# Altium schematic sheet Melanson Tech - PWM Generator.SchDoc
size B
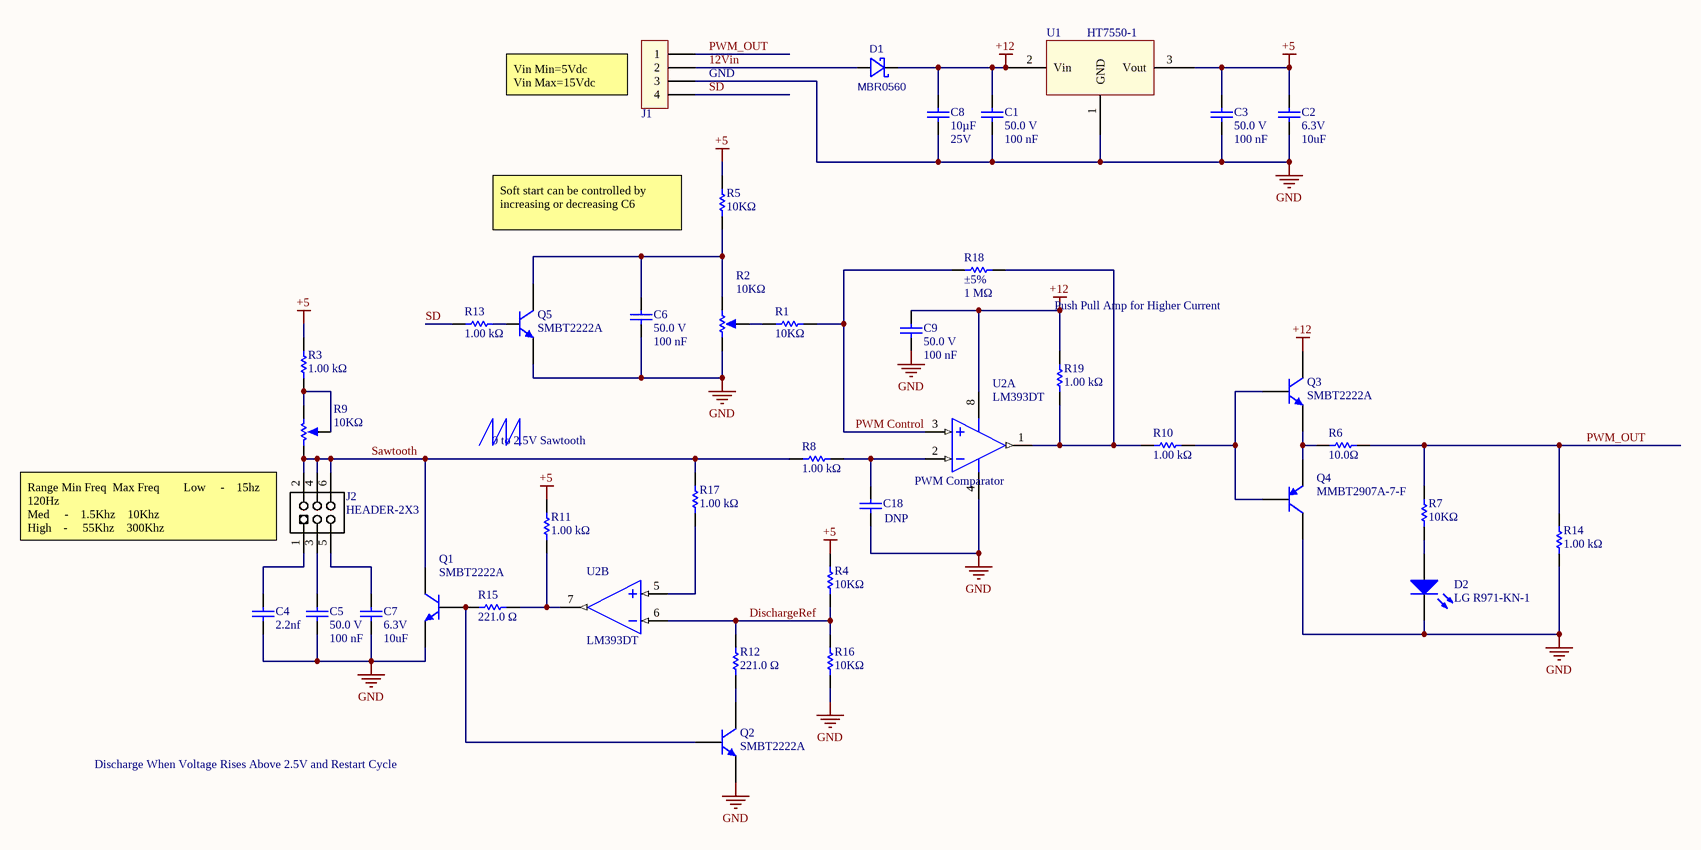
[diagram p0: Melanson Tech - PWM Generator.SchDoc]

## Parts
C1  Voltage Rating (DC): 50.0 V  Capacitance: 100 nF  [Cap,0805]  (hidden comment: 08055C104JAT2A)
C2  Voltage - Rated: 6.3V  Capacitance: 10uF  [Cap,0805]  (hidden comment: CL21A106KQFNNNG)
C3  Voltage Rating (DC): 50.0 V  Capacitance: 100 nF  [Cap,0805]  (hidden comment: 08055C104JAT2A)
C4  2.2nf  [CAP, 0805, HD]
C5  Voltage Rating (DC): 50.0 V  Capacitance: 100 nF  [Cap,0805]  (hidden comment: 08055C104JAT2A)
C6  Voltage Rating (DC): 50.0 V  Capacitance: 100 nF  [Cap,0805]  (hidden comment: 08055C104JAT2A)
C7  Voltage - Rated: 6.3V  Capacitance: 10uF  [Cap,0805]  (hidden comment: CL21A106KQFNNNG)
C8  Capacitance: 10µF  Voltage - Rated: 25V  [Cap, 1206]  (hidden comment: C3216X7R1E106K160AB)
C9  Voltage Rating (DC): 50.0 V  Capacitance: 100 nF  [Cap,0805]  (hidden comment: 08055C104JAT2A)
C18  Capacitance: DNP  [CAP, 0805, HD]  (hidden comment: GRM21A5C2E101JW01D)
D1  MBR0560  [SOD123]
D2  LG R971-KN-1  [LED,0805]
J1  Generic Header  [Header,4POS,0.1",Vert]  (value not drawn)
J2  HEADER-2X3  [HEADER-2X3]
Q1  SMBT2222A  [SOT23-3]
Q2  SMBT2222A  [SOT23-3]
Q3  SMBT2222A  [SOT23-3]
Q4  MMBT2907A-7-F  [SOT23-3]
Q5  SMBT2222A  [SOT23-3]
R1  Resistance: 10KΩ  [res, 0805, HD]  (hidden comment: Vishay / Dale CRCW080510K0FKTA)
R2  Resistance: 10KΩ  [Res,TH,POT,TopAdj]  (hidden comment: CT94EW103)
R3  Resistance: 1.00 kΩ  [res, 0805, HD]  (hidden comment: Vishay CRCW08051K00JNEA)
R4  Resistance: 10KΩ  [res, 0805, HD]  (hidden comment: Vishay / Dale CRCW080510K0FKTA)
R5  Resistance: 10KΩ  [res, 0805, HD]  (hidden comment: Vishay / Dale CRCW080510K0FKTA)
R6  Resistance: 10.0Ω  [res, 0805, HD]  (hidden comment: RMCF0805JT10R0)
R7  Resistance: 10KΩ  [res, 0805, HD]  (hidden comment: Vishay / Dale CRCW080510K0FKTA)
R8  Resistance: 1.00 kΩ  [res, 0805, HD]  (hidden comment: Vishay CRCW08051K00JNEA)
R9  Resistance: 10KΩ  [Res,TH,POT,TopAdj]  (hidden comment: CT94EW103)
R10  Resistance: 1.00 kΩ  [res, 0805, HD]  (hidden comment: Vishay CRCW08051K00JNEA)
R11  Resistance: 1.00 kΩ  [res, 0805, HD]  (hidden comment: Vishay CRCW08051K00JNEA)
R12  Resistance: 221.0 Ω  [res, 0805, HD]  (hidden comment: Vishay Dale CRCW0805221RFKTA)
R13  Resistance: 1.00 kΩ  [res, 0805, HD]  (hidden comment: Vishay CRCW08051K00JNEA)
R14  Resistance: 1.00 kΩ  [res, 0805, HD]  (hidden comment: Vishay CRCW08051K00JNEA)
R15  Resistance: 221.0 Ω  [res, 0805, HD]  (hidden comment: Vishay Dale CRCW0805221RFKTA)
R16  Resistance: 10KΩ  [res, 0805, HD]  (hidden comment: Vishay / Dale CRCW080510K0FKTA)
R17  Resistance: 1.00 kΩ  [res, 0805, HD]  (hidden comment: Vishay CRCW08051K00JNEA)
R18  Tolerance: ±5%  Resistance: 1 MΩ  [res, 0805, HD]  (hidden comment: CR0805-JW-105ELF)
R19  Resistance: 1.00 kΩ  [res, 0805, HD]  (hidden comment: Vishay CRCW08051K00JNEA)
U1  HT7550-1  [SOT89-3]
U2  LM393DT  [SOIC-8]  (parts A,B of 2)

## Nets
+5: C2.2 C3.2 R3.2 R4.2 R5.2 R11.2 U1.3(Vout)
+12: C1.2 C8.2 C9.2 D1.1(C) Q3.3(C) R19.1 U1.2(Vin) U2.8(Vcc)
GND: C1.1 C2.1 C3.1 C4.1 C5.1 C6.1 C7.1 C8.1 C9.1 C18.2 D2.2(K) J1.3 Q1.2(E) Q2.2(E) Q4.3(C) Q5.2(E) R2.3 R14.2 R16.1 U1.1(GND) U2.4(Gnd)
12Vin: D1.2(A) J1.2
DischargeRef: R4.1 R12.1 R16.2 U2.6(IN2-)
PWM Control: R1.1 R18.2 U2.3(IN1+)
PWM_OUT: J1.1 R6.1 R7.2 R14.1
Sawtooth: J2.2 J2.4 J2.6 Q1.3(C) R8.1 R9.1 R17.2
SD: J1.4 R13.1
NetC4_2: C4.2 J2.1
NetC5_2: C5.2 J2.3
NetC6_2: C6.2 Q5.3(C) R2.1 R5.1
NetC7_2: C7.2 J2.5
NetC18_1: C18.1 R8.2 U2.2(IN1-)
NetD2_1: D2.1(A) R7.1
NetQ1_1: Q1.1(B) Q2.1(B) R15.2
NetQ2_3: Q2.3(C) R12.2
NetQ3_1: Q3.1(B) Q4.1(B) R10.2
NetQ3_2: Q3.2(E) Q4.2(E) R6.2
NetQ5_1: Q5.1(B) R13.2
NetR1_2: R1.2 R2.2
NetR3_1: R3.1 R9.2 R9.3
NetR10_1: R10.1 R18.1 R19.2 U2.1(OUT1)
NetR11_1: R11.1 R15.1 U2.7(OUT2)
NetR17_1: R17.1 U2.5(IN2+)

## Notes on the sheet
- (near J1) Vin Min=5Vdc
  Vin Max=15Vdc
- (near J1) GND
- (near R5) Soft start can be controlled by increasing or decreasing C6
- Push Pull Amp for Higher Current
- (near R17) 0 to 2.5V Sawtooth
- (near U2) PWM Comparator
- Range	Min Freq		Max Freq        Low     - 	  15hz		  120Hz
  Med     - 	  1.5Khz		  10Khz
  High    -  	  55Khz		  300Khz
- (near Q2) Discharge When Voltage Rises Above 2.5V and Restart Cycle

## Library data of the parts
C1 C3 C5 C6 C9 = Cap,0805,100nf,50V,5%,08055C104JAT2A: Capacitor; Ceramic; Cap 0.1 uF; Tol 5%; Vol-Rtg 50 VDC; SMT; 0805; X7R; Tape & Reel; Lead-Free Status: Lead Free; Case/Package (SI): 2012; Insulation Resistance: 100 GΩ; Detailed Description: 0.1µF ±5% 50V Ceramic Capacitor X7R 0805 (2012 Metric); Mounting Style: Surface Mount; Packaging: Tape & Reel (TR), Cut Tape (CT); RoHS: Compliant; Size-Width: 1.24 mm; Case/Package: 0805; Number of Pins: 2; digikey url: http://www.digikey.ca/product-detail/en/avx-corporation/08055C104JAT2A/478-3352-1-ND/930144; REACH SVHC Compliance: No SVHC; Dielectric Characteristic: X7R; Capacitance Tolerance: ±5%; Size-Length: 2.01 mm; Size-Height: 710 µm; Size-Thickness: 940 µm; Manufacturer Part Number: 08055C104JAT2A; Octopart URL: http://octopart.com/08055c104jat2a-avx-55388010; Operating Temperature: -55°C ~ 125°C; Supplier 1: Digi-Key; Supplier Part Number 1: 478-3352-1-ND
C2 C7 = Cap,0805,10uf,6.3V,10%,CL21A106KQFNNNG: CL21 Series 10 uF 6.3V ±10 % Tolerance X5R SMT Multilayer Ceramic Capacitor; Lead-Free Status: Lead Free; Tolerance: ±10%; Other Names: 1276-6457-2; RoHS: Compliant; mfg P/N: CL21A106KQFNNNG; Mounting Style: Surface Mount; Operating Temperature: -55°C ~ 85°C; Applications: General Purpose; Package / Case: 0805 (2012 Metric); Supplier 1: Digi-Key; Supplier Part Number 1: 1276-6457-1-ND
C4 = CAP,0805,Generic
C8 = CAP,1206,10uF,25V,C3216X7R1E106K160AB: 10µF ±10% 25V Ceramic Capacitor X7R 1206 (3216 Metric); Manufacturer: TDK Corporation; Features Low: ESL; mfg P/N: C3216X7R1E106K160AB; Tolerance: ±10%; Temperature Coefficient: X7R; Operating Temperature: -55°C ~ 125°C; Applications: General Purpose; Mounting Type: Surface Mount, MLCC; Package / Case: 1206 (3216 Metric); Size / Dimension: 0.126" L x 0.063" W (3.20mm x 1.60mm); Thickness (Max): 0.075" (1.90mm); Supplier 1: Digi-Key; Supplier Part Number 1: 445-7705-1-ND
C18 = Cap,0805,100pf,250V,5%,GRM21A5C2E101JW01D: CAP CER 100PF 250V 5% NP0 0805; Dielectric Characteristic: C0G/NP0; Lead-Free Status: Lead Free; Voltage Rating (DC): 250.0 V; Capacitance Tolerance: ±5%; Case/Package: 0805; RoHS: Compliant; Size-Length: 0.002 m; Size-Thickness: 0.001 m; Size-Width: 0.00125 m; mfg P/N: GRM21A5C2E101JW01D; Supplier 1: Digi-Key; Supplier Part Number 1: 490-5542-1-ND; Supplier 2: LCSC; Supplier Part Number 2: C162304
D1 = Diode,SOD123,Shottky,60V,0.5A,MBR0560: Dio,Sig,Schtky,0.5A,60V,SOD123; Manufacturer: MCC; mfg P/N: MBR0560-TP; Details: 700mV @ 500mA, 200µA @ 60V,30pF @ 4V, 1MHz; Not Stuffed: N/S; Fast Supplier: Digi-Key; Current: 0.5A; Package: SOD123; Voltage: 60V; Supplier 1: Digi-Key; Supplier Part Number 1: MBR0560TPMSCT-ND; Supplier 2: LCSC; Supplier Part Number 2: C150515
D2 = LED,0805, Green,SMD,LG R971-KN-1: LED GREEN DIFFUSED 0805 SMD; mfg P/N: LTST-C930KRKT; Viewing Angle: 160°; Lead-Free Status: Lead Free; Forward Voltage: 2.2V; Categories: Optoelectronics   LED Indication - Discrete; Configuration: Standard; Lens Color: White; Millicandela Rating: 26.05mcd; Lens Style: Rectangle with Flat Top; Lens Size: 1.30mm x 1.25mm; Current - Test: 20mA; Wavelength - Dominant: 570nm; Wavelength - Peak: 572nm; Lens Type: Diffused; Mounting Style: Surface Mount; RoHS: Compliant; Color: Green; Package / Case: 0805 (2012 Metric); Supplier Device Package: 0805; Size / Dimension: 2.00mm L x 1.25mm W; Height (Max): 0.90mm; Supplier 1: Digi-Key; Supplier Part Number 1: 475-1410-1-ND
J1 = Header 1x4,0.1",TH,Generic: Generic Header 4 pos header 0.1"
Q1-Q3 Q5 = Trans,40V,600mA,0.33W, SMBT2222A: NPN Silicon Switching Transistor, 40 V VCEO, 600 mA IC, SOT23, Reel, Green; Power Dissipation: 0.33 W; Voltage - Collector Emitter Breakdown (Max): 40V; Vce Saturation (Max) @ Ib, Ic: 1V @ 50mA, 500mA; Current - Collector Cutoff (Max): 10nA (ICBO); DC Current Gain (hFE) (Min) @ Ic, Vce: 100 @ 150mA, 10V; Frequency - Transition: 300MHz; Mounting Style: Surface Mount; Number of Pins: 3; Packaging: Cut Tape (CT); Polarity: NPN; REACH SVHC Compliance: No SVHC; RoHS: Compliant; Mounting Type: Surface Mount; Package / Case: TO-236-3, SC-59, SOT-23-3; Supplier Device Package: SOT-23-3; Supplier 1: Digi-Key; Supplier Part Number 1: SMBT2222AE6327HTSA1CT-ND; Supplier 2: Digi-Key; Supplier Part Number 2: MMBT2222ALT1HTSA1CT-ND; Supplier 3: Digi-Key; Supplier Part Number 3: SMBT2222AE6327HTSA1DKR-ND; Supplier 4: LCSC; Supplier Part Number 4: C151510; mfg P/N: SMBT2222A
Q4 = Trans,PNP,60Vdc,600mA,SOT-23-3,MMBT2907A-7-F: TRANS PNP 60V 0.6A SOT23-3; Detailed Description: Bipolar (BJT) Transistor PNP 60V 600mA 200MHz 300mW Surface Mount SOT-23-3; Current - Collector (Ic) (Max): 600mA; Vce Saturation (Max) @ Ib, Ic: 1.6V @ 50mA, 500mA; Current - Collector Cutoff (Max): 10nA (ICBO); DC Current Gain (hFE) (Min) @ Ic, Vce: 100 @ 150mA, 10V; Power - Max: 300mW; Frequency - Transition: 200MHz; mfg P/N: MMBT2907A-7-F; Transistor Type: PNP; Voltage - Collector Emitter Breakdown (Max): 60V; Operating Temperature: -55°C ~ 150°C (TJ); Mounting Type: Surface Mount; Package / Case: TO-236-3, SC-59, SOT-23-3; Supplier Device Package: SOT-23-3; Supplier 1: Digi-Key; Supplier Part Number 1: MMBT2907A-FDICT-ND; Supplier 2: LCSC; Supplier Part Number 2: C106923
R1 R4 R5 R7 R16 = Res,0805,10.0kΩ,1%,100 ppm,CRCW080510K0FKTA: RES SMD 10K OHM 1% 1/8W 0805; Temperature Coefficient: 100.0 ppm/C; Lead-Free Status: Contains Lead; Voltage Rating (DC): 150.0 V; Power Rating: 0.125 W; Case/Package (SI): 2012; Size-Width: 0.00125 m; Resistance Tolerance: 1%; Size-Length: 0.002 m; RoHS: Non-Compliant; Power Dissipation: 0.125 W; Number of Pins: 2; REACH SVHC Compliance: No SVHC; Size-Height: 0.00045 m; Case/Package: 0805; Mounting Style: Surface Mount; Supplier 1: Digi-Key; Supplier Part Number 1: 541-3016-1-ND
R2 R9 = Res,POT,TH,10KΩ,0.5W,±10%,±100ppm/°C,CT94EW103: TRIMMER 10K OHM 0.5W PC PIN TOP; Manufacturer: Nidec Copal Electronics; Detailed Description: 10 kOhms 0.5W, 1/2W PC Pins Through Hole Trimmer Potentiometer Cermet 18 Turn Top Adjustment; Power (Watts): 0.5W, 1/2W; Tolerance: ±10%; Adjustment Type: Top Adjustment; Resistive Material: Cermet; Number of Turns: 18; mfg P/N: CT94EW103; Category: Potentiometers, Variable Resistors; Series: CT94; Part Status: Active; Temperature Coefficient: ±100ppm/°C; Mounting Type: Through Hole; Termination Style: PC Pins; Size / Dimension: Square - 0.378"" L x 0.189"" W x 0.378"" H (9.60mm x 4.80mm x 9.60mm); Supplier 1: Digi-Key; Supplier Part Number 1: CT94EW103-ND
R3 R8 R10 R11 R13 R14 R17 R19 = Res,0805,1.00 kΩ,5%,200ppm,CRCW08051K00JNEA: Res Thick Film 0805 1K Ohm 5% 0.125W(1/8W) ±200ppm/C Molded SMD Automotive Paper T/R; Power Rating: 125 mW; Case/Package (SI): 2012; Lead-Free Status: Lead Free; Temperature Coefficient: 200 ppm/°C; Voltage Rating (DC): 150 V; Size-Width: 1.25 mm; Mounting Style: Surface Mount; REACH SVHC Compliance: No SVHC; Manufacturer Part Number: CRCW08051K00JNEA; Number of Pins: 2; Size-Height: 450 µm; Packaging: Tape & Reel (TR), Cut Tape (CT); RoHS: Compliant; Resistance Tolerance: ±5%; Case/Package: 0805; Size-Length: 2.00 mm; Supplier 1: Digi-Key; Supplier Part Number 1: 541-1.0KADKR-ND; Supplier 2: Digi-Key; Supplier Part Number 2: 541-1.0KACT-ND
R6 = Res,0805,10.0Ω,5%,±200ppm/°C,RMCF0805JT10R0: RES 10 OHM 5% 1/8W 0805; Manufacturer: Stackpole Electronics Inc; Detailed Description: 10 Ohms ±5% 0.125W, 1/8W Chip Resistor 0805 (2012 Metric) Automotive AEC-Q200 Thick Film; Categories: Resistors   Chip Resistor - Surface Mount; Power (Watts): 0.125W, 1/8W; mfg P/N: RMCF0805JT10R0; Ratings: AEC-Q200; Supplier Device Package: 0805; Part Status: Active; Series: RMCF; Tolerance: ±5%; Composition: Thick Film; Features: Automotive AEC-Q200; Temperature Coefficient: ±200ppm/°C; Operating Temperature: -55°C ~ 155°C; Package / Case: 0805 (2012 Metric); Supplier 1: Digi-Key; Supplier Part Number 1: RMCF0805JT10R0CT-ND
R12 R15 = Res,0805,221Ω,1%,100ppm,CRCW0805221RFKTA: RES SMD 221 OHM 1% 1/8W 0805; Case/Package (SI): 2012; Lead-Free Status: Contains Lead; Power Dissipation: 0.125 W; Temperature Coefficient: 100.0 ppm/°C; Voltage Rating (DC): 150.0 V; Case/Package: 0805; Mounting Style: Surface Mount; Number of Pins: 2; Power Rating: 0.125 W; Resistance Tolerance: ±1%; RoHS: Non-Compliant; Size-Height: 0.00045 m; Size-Length: 0.002 m; Size-Width: 0.00125 m; Supplier 1: Digi-Key; Supplier Part Number 1: 541-221CCT-ND
R18 = Res,0805,1MegΩ,5%,200ppm,0805W8F1005T5E: RES SMD 1M OHM 5% 1/8W 0805; Manufacturer: Bourns Inc.; Detailed Description: 1 MOhms ±5% 0.125W, 1/8W Chip Resistor 0805 (2012 Metric) Moisture Resistant Thick Film; Power (Watts): 0.125W, 1/8W; Temperature Coefficient: ±200ppm/°C; mfg P/N: CR0805-JW-105ELF; Category: Resistors  Chip Resistor - Surface Mount; Series: CR0805; Part Status: Active; Composition: Thick Film; Features: Moisture Resistant; Operating Temperature: -55°C ~ 155°C; Package / Case: 0805 (2012 Metric); Supplier Device Package: 0805; Size / Dimension: 0.079"" L x 0.049"" W (2.00mm x 1.25mm); Height - Seated (Max): 0.024"" (0.60mm); Supplier 1: Digi-Key; Supplier Part Number 1: CR0805-JW-105ELFCT-ND; JLC ALt LCSC Part #: C26108
U1 = Reg,Linear,Fixed,SOT-89-3,30Vin,5Vout,150mA,HT7550-1: LOW DROPOUT REGULATORS(LDO) POSITIVE FIXED 55MV @ 1MA 30V 5V 150MA SOT-89(SOT-89-3) ROHS; Manufacturer: Holtek Semicon; Input Voltage (Max): 30Vdc; Output voltage accuracy: tolerance ±3%; Quiescent current: 2.5μA; Output Voltage: 5Vdc; LCSC Part #: C16106; Package: SOT-89-3; Output Current (Max): 150mA; mfg P/N: HT7550-1
U2 = OPAMP,DUAL,COMAPRATOR,SOIC8,OPEN-COLLECTOR,LM393DT: IC COMPARATOR LP DUAL 8-SOIC; Manufacturer: STMicroelectronics; Number of Elements: 2; Output Type: CMOS, DTL, ECL, MOS, Open-Collector, TTL; Voltage - Supply, Single/Dual (±): 2V ~ 36V, ±1V ~ 18V; Voltage - Input Offset (Max): 5mV @ 30V; Current - Input Bias (Max): 0.25µA @ 5V; Current - Output (Typ): 18mA @ 5V; Current - Quiescent (Max): 2.5mA; Package / Case 8-SOIC: (0.154", 3.90mm Width); mfg P/N:: LM393DT; Part Status: Active; Type: General Purpose; Operating Temperature: 0°C ~ 70°C; Mounting Type: Surface Mount; Supplier Device Package: 8-SO; Base Part Number: LM393; Supplier 1: Digi-Key; Supplier Part Number 1: 497-1593-1-ND; Supplier 2: LCSC; Supplier Part Number 2: C32901